# Altium schematic sheet SD CARD.SchDoc
size A4
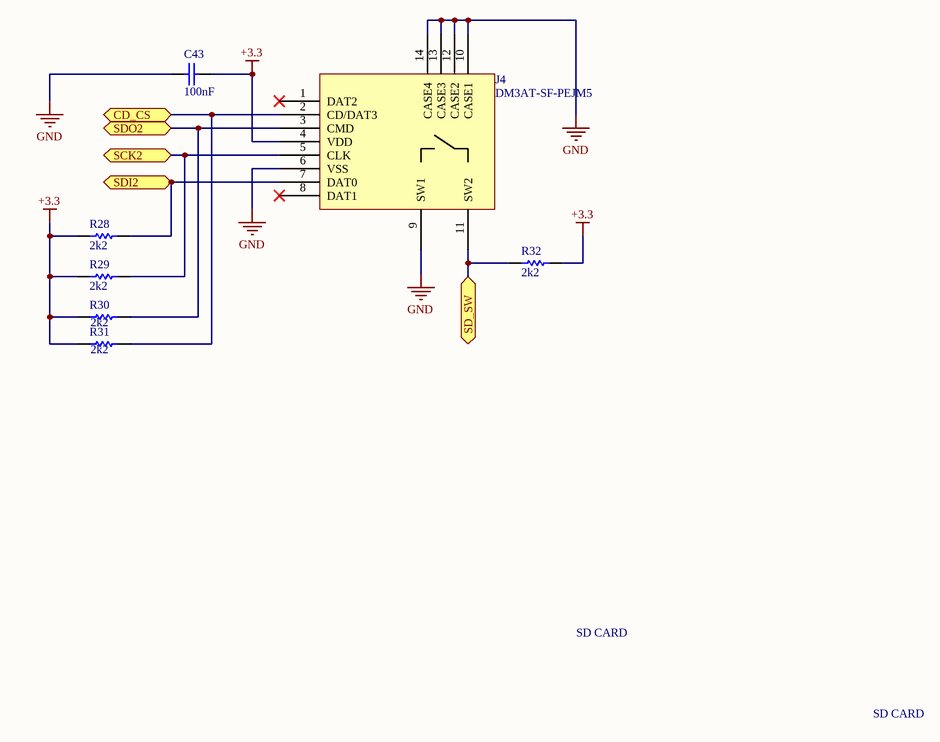
[diagram p0: SD CARD.SchDoc]

## Parts
C43  value 100nF  [WCAP-CSGP_0603, 1.6x0.8x0.8mm_Reflow]  (hidden comment: 885012206020)
J4  DM3AT-SF-PEJM5  [SD CARD MICRO]
R28  2k2  [3-0603]
R29  2k2  [3-0603]
R30  2k2  [3-0603]
R31  2k2  [3-0603]
R32  2k2  [3-0603]

## Ports
CD_CS, SCK2, SD_SW, SDI2, SDO2

## Nets
+3.3: C43.2 J4.4(VDD) R28.1 R29.1 R30.1 R31.1 R32.2
GND: C43.1 J4.6(VSS) J4.9(SW1) J4.10(CASE1) J4.12(CASE2) J4.13(CASE3) J4.14(CASE4)
CD_CS: J4.2(CD/DAT3) R31.2 ; port CD_CS
SCK2: J4.5(CLK) R29.2 ; port SCK2
SD_SW: J4.11(SW2) R32.1 ; port SD_SW
SDI2: J4.7(DAT0) R28.2 ; port SDI2
SDO2: J4.3(CMD) R30.2 ; port SDO2

Not connected (* = marked no-connect by the designer): J4 1(DAT2)* 8(DAT1)*

## Notes on the sheet
- SD CARD

## Library data of the parts
C43 = 885012206020: WCAP-CSGP Ceramic Capacitors, size 0603, 1.6x0.8x0.8mm, 10V, X7R, 100nF; Rated Voltage: 10V DC; ComponentLink1Description: Manufacturer; ComponentLink1URL: http://www.we-online.de; ComponentLink2Description: Datasheet; ComponentLink2URL: http://katalog.we-online.de/pbs/datasheet/885012206020.pdf; Part Number: 885012206020; Published Date: June 2017; Publisher: Wurth Elektronik; Size: 0603, 1.6x0.8x0.8mm; Ceramic Type: X7R
J4 = DM3AT-SF-PEJM5: Conector micro SD push/push
R28-R32 = ERJ3RE: Precision Thick Film Chip Resistor, 10 Ohm to 1M Ohm Range, 1% and 0.5% Tolerance, 0603 Size, 0.063 W; Published: 17-Dec-2003; LatestRevisionDate: 19-Mar-2004; LatestRevisionNote: Silkscreen size reduced.; PackageDocument: Mar-2003; PackageReference: 3-0603; Publisher: Altium Limited; Code_IPC: 1608 [0603]; ComponentLink1Description: Manufacturer Link; ComponentLink1URL: http://www.panasonic.com/industrial/components/resistive_products.htm; ComponentLink2Description: Datasheet; ComponentLink2URL: http://www.panasonic.com/industrial/components/pdf/AOA0000CE2.pdf